# EasyEDA schematic SCH_hackfest_2025-04-05_final.json
TITLE: Sheet_1; REV: 1.0; Date: 2025-04-04; Sheet: 1/1; Drawn By: pcb_maker_gib; Company: Your Company
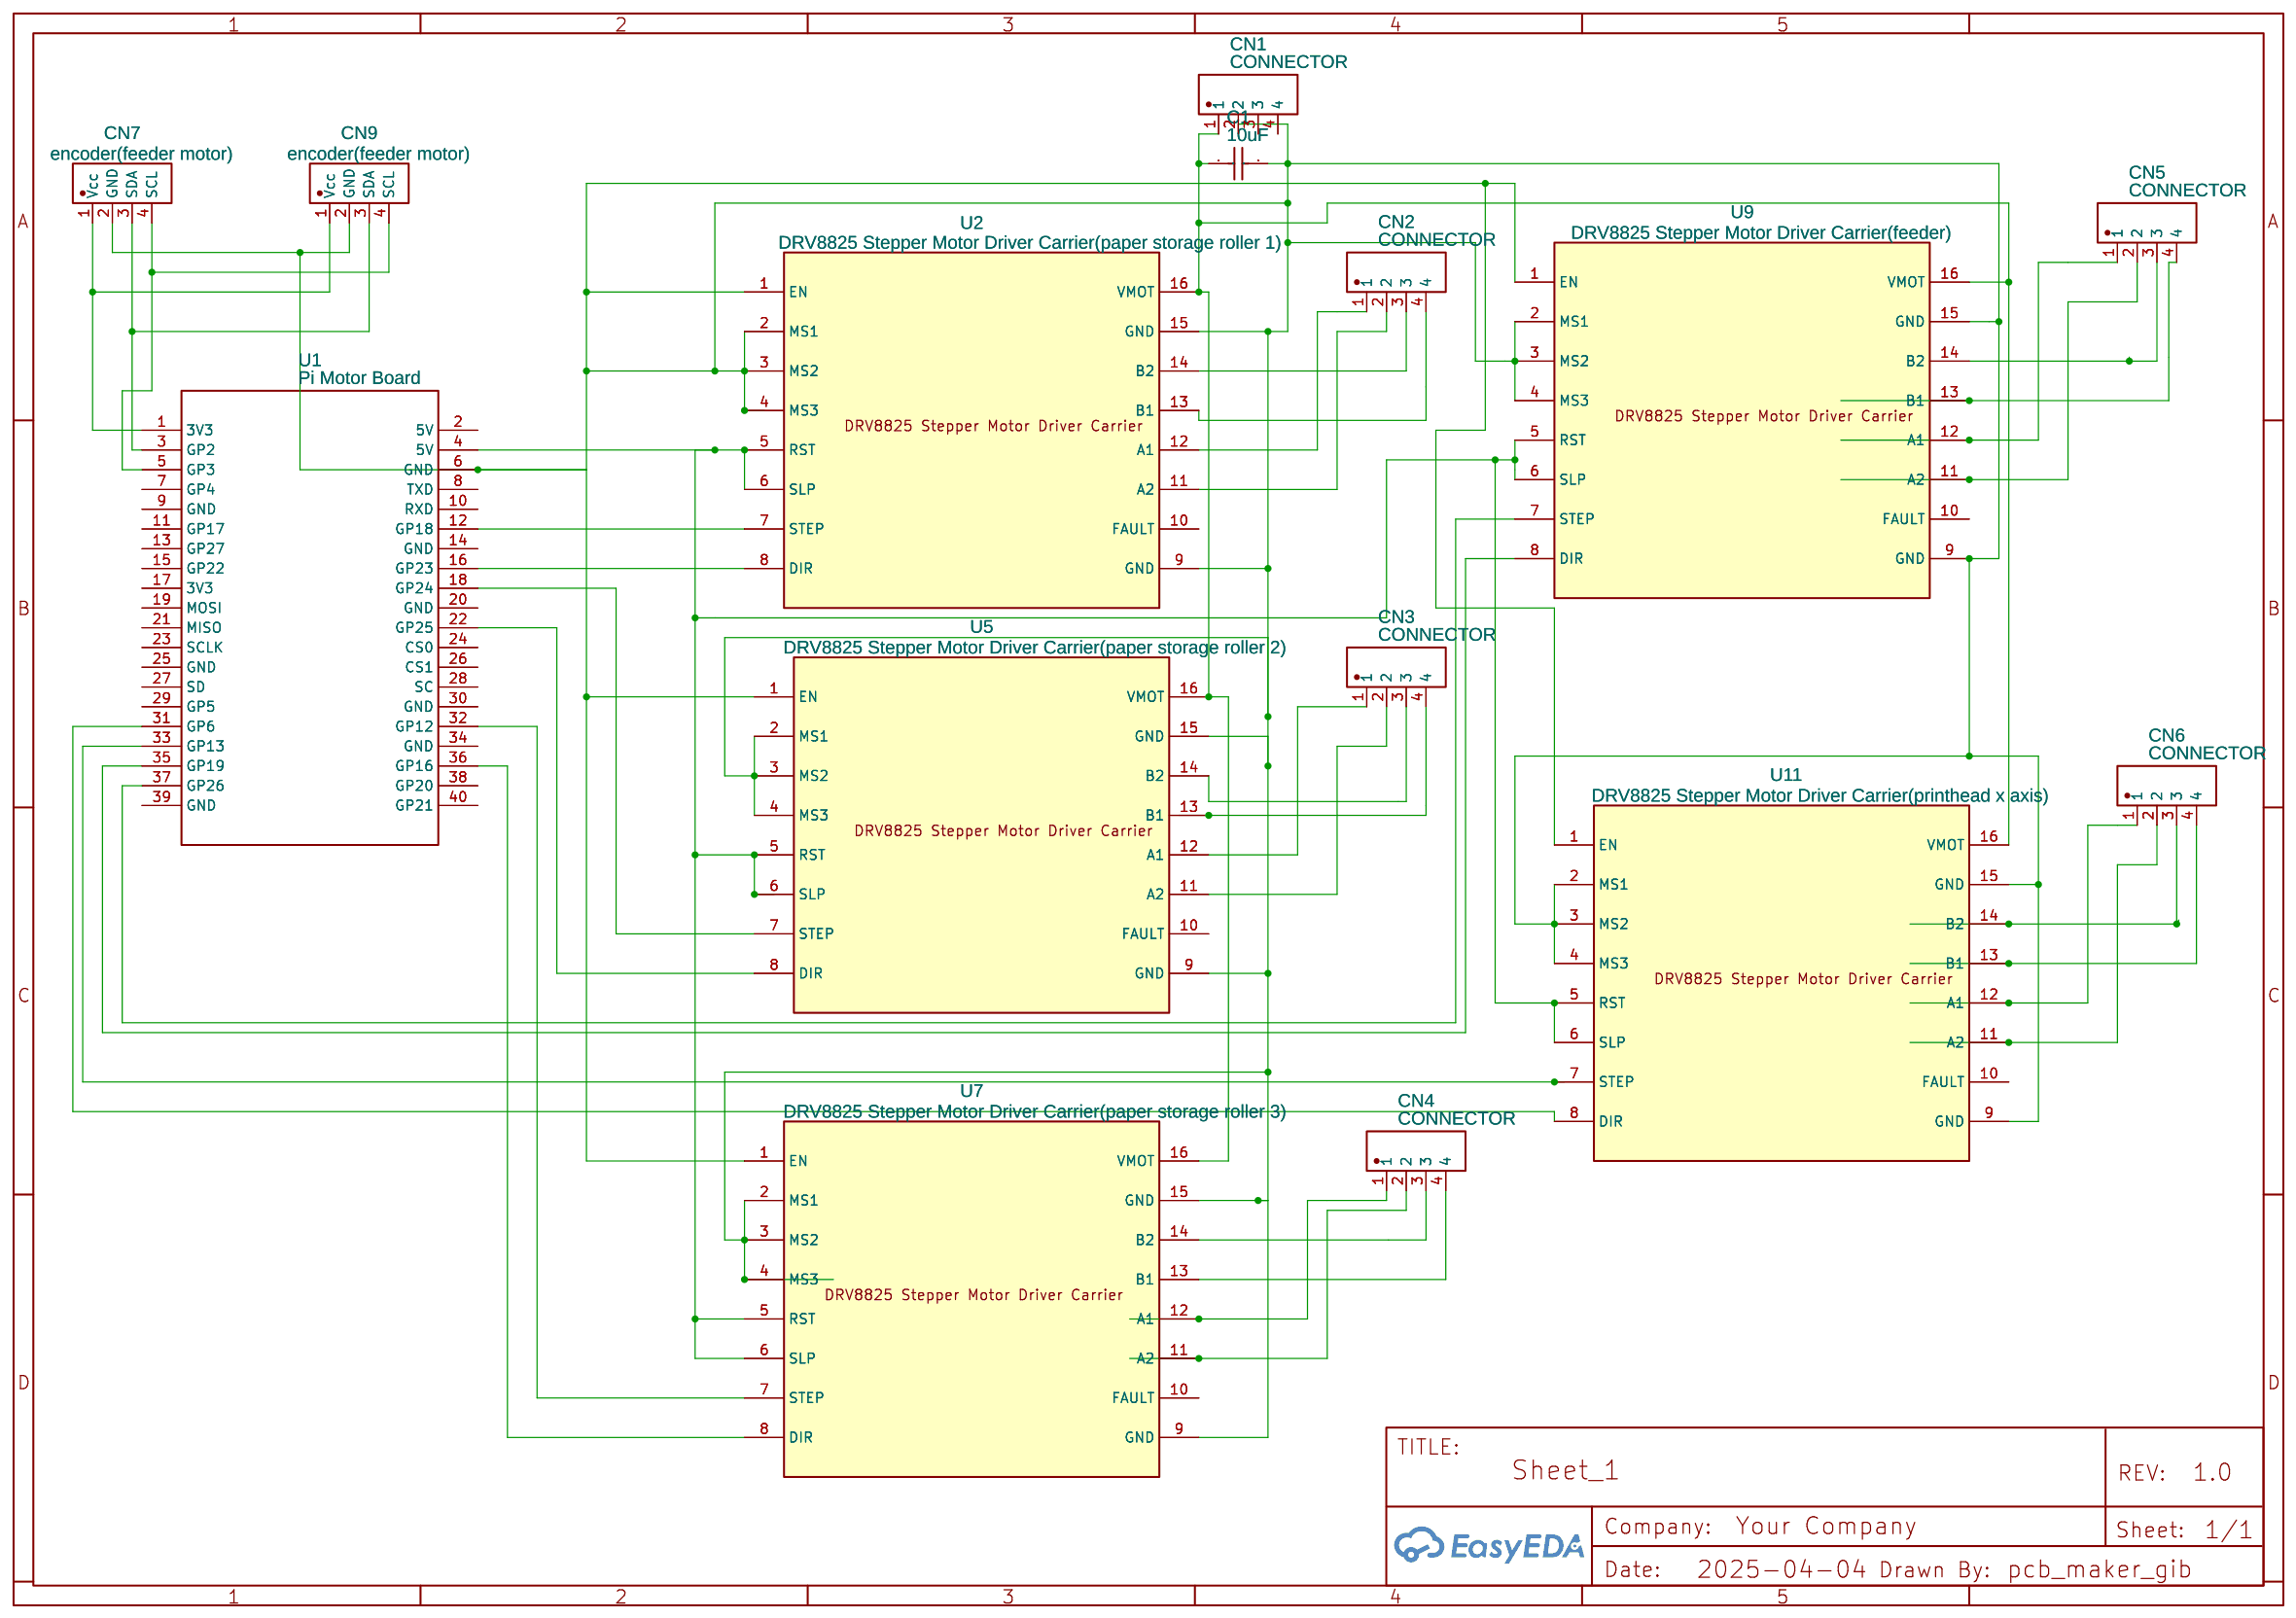
[diagram p0: schematic sheet]

## Parts
C1  10uF  [CAP-TH_L6.5-W4.0-P5.00-D1.0]
CN1  CONNECTOR  [CONN-TH_CONNECTOR]
CN2  CONNECTOR  [CONN-TH_CONNECTOR]
CN3  CONNECTOR  [CONN-TH_CONNECTOR]
CN4  CONNECTOR  [CONN-TH_CONNECTOR]
CN5  CONNECTOR  [CONN-TH_CONNECTOR]
CN6  CONNECTOR  [CONN-TH_CONNECTOR]
CN7  encoder(feeder motor)  [CONN-TH_CONNECTOR]
CN9  encoder(feeder motor)  [CONN-TH_CONNECTOR]
U1  Pi Motor Board  [PI MOTOR BOARD]
U2  DRV8825 Stepper Motor Driver Carrier(paper storage roller 1)  [DRV8825 STEPPER MOTOR DRIVER CARRIER]
U5  DRV8825 Stepper Motor Driver Carrier(paper storage roller 2)  [DRV8825 STEPPER MOTOR DRIVER CARRIER]
U7  DRV8825 Stepper Motor Driver Carrier(paper storage roller 3)  [DRV8825 STEPPER MOTOR DRIVER CARRIER]
U9  DRV8825 Stepper Motor Driver Carrier(feeder)  [DRV8825 STEPPER MOTOR DRIVER CARRIER]
U11  DRV8825 Stepper Motor Driver Carrier(printhead x axis)  [DRV8825 STEPPER MOTOR DRIVER CARRIER]

## Library data of the parts
C1 = CAPACITOR15NF100V: Contributor: LCSC; Supplier: LCSC; Manufacturer: null; Manufacturer Part: 电容15nf100v; Supplier Part: C26191; JLCPCB Part Class: Extended Part
CN1-CN7 CN9 = CONNECTOR: Contributor: LCSC; Supplier: LCSC; Supplier Part: C9900011140; Manufacturer: null; JLCPCB Part Class: Extended Part
U1 = Pi Motor Board: sourceId: WJDVrJDVd; Supplier Part: undefined; Supplier: SeeedStudio
U2 U5 U7 U9 U11 = DRV8825 Stepper Motor Driver Carrier: Contributor: winter2015; sourceId: YsmgyP7pj

## Nets
Net-(C1-1): C1.1 CN1.1 U2.16(VMOT) U5.16(VMOT) U7.16(VMOT) U9.16(VMOT) U11.16(VMOT)
Net-(C1-2): C1.2 CN1.2 CN7.2(GND) CN9.2(GND) U1.6(GND) U2.1(EN) U2.2(MS1) U2.3(MS2) U2.4(MS3) U2.9(GND) U2.15(GND) U5.1(EN) U5.2(MS1) U5.3(MS2) U5.4(MS3) U5.9(GND) U5.15(GND) U7.1(EN) U7.2(MS1) U7.3(MS2) U7.4(MS3) U7.9(GND) U7.15(GND) U9.1(EN) U9.2(MS1) U9.3(MS2) U9.4(MS3) U9.9(GND) U9.15(GND) U11.1(EN) U11.2(MS1) U11.3(MS2) U11.4(MS3) U11.9(GND) U11.15(GND)
Net-(CN2-1): CN2.1 U2.12(A1)
Net-(CN2-2): CN2.2 U2.11(A2)
Net-(CN2-3): CN2.3 U2.14(B2)
Net-(CN2-4): CN2.4 U2.13(B1)
Net-(CN3-1): CN3.1 U5.12(A1)
Net-(CN3-2): CN3.2 U5.11(A2)
Net-(CN3-3): CN3.3 U5.14(B2)
Net-(CN3-4): CN3.4 U5.13(B1)
Net-(CN4-1): CN4.1 U7.12(A1)
Net-(CN4-2): CN4.2 U7.11(A2)
Net-(CN4-3): CN4.3 U7.14(B2)
Net-(CN4-4): CN4.4 U7.13(B1)
Net-(CN5-1): CN5.1 U9.12(A1)
Net-(CN5-2): CN5.2 U9.11(A2)
Net-(CN5-3): CN5.3 U9.14(B2)
Net-(CN5-4): CN5.4 U9.13(B1)
Net-(CN6-1): CN6.1 U11.12(A1)
Net-(CN6-2): CN6.2 U11.11(A2)
Net-(CN6-3): CN6.3 U11.14(B2)
Net-(CN6-4): CN6.4 U11.13(B1)
Net-(CN7-1): CN7.1(Vcc) CN9.1(Vcc) U1.1(3V3)
Net-(CN7-3): CN7.3(SDA) CN9.3(SDA) U1.3(GP2)
Net-(CN7-4): CN7.4(SCL) CN9.4(SCL) U1.5(GP3)
Net-(U1-4): U1.4(5V) U2.5(RST) U2.6(SLP) U5.5(RST) U5.6(SLP) U7.5(RST) U7.6(SLP) U9.5(RST) U9.6(SLP) U11.5(RST) U11.6(SLP)
Net-(U1-12): U1.12(GP18) U2.7(STEP)
Net-(U1-16): U1.16(GP23) U2.8(DIR)
Net-(U1-18): U1.18(GP24) U5.7(STEP)
Net-(U1-22): U1.22(GP25) U5.8(DIR)
Net-(U1-31): U1.31(GP6) U11.8(DIR)
Net-(U1-32): U1.32(GP12) U7.7(STEP)
Net-(U1-33): U1.33(GP13) U11.7(STEP)
Net-(U1-35): U1.35(GP19) U9.8(DIR)
Net-(U1-36): U1.36(GP16) U7.8(DIR)
Net-(U1-37): U1.37(GP26) U9.7(STEP)

Not connected (* = marked no-connect by the designer): CN1 3 4; U1 2(5V) 7(GP4) 8(TXD) 9(GND) 10(RXD) 11(GP17) 13(GP27) 14(GND) 15(GP22) 17(3V3) 19(MOSI) 20(GND) 21(MISO) 23(SCLK) 24(CS0) 25(GND) 26(CS1) 27(SD) 28(SC) 29(GP5) 30(GND) 34(GND) 38(GP20) 39(GND) 40(GP21); U2 10(FAULT); U5 10(FAULT); U7 10(FAULT); U9 10(FAULT); U11 10(FAULT)
